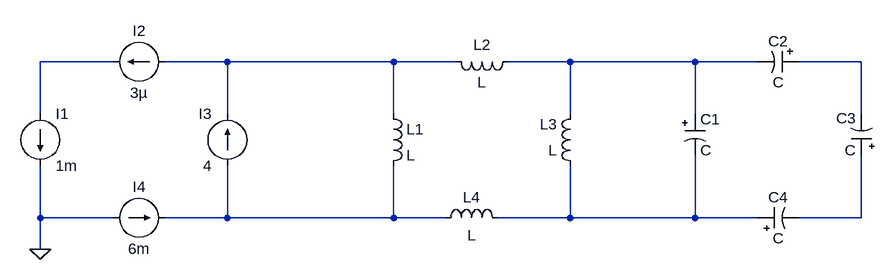
[diagram p0: schematic orientation-test2.asc]
orientation-test2.asc, the LTspice schematic file:
Version 4
SHEET 1 1316 680
WIRE 144 176 32 176
WIRE 320 176 224 176
WIRE 576 176 320 176
WIRE 672 176 576 176
WIRE 848 176 752 176
WIRE 1040 176 848 176
WIRE 1136 176 1040 176
WIRE 1296 176 1200 176
WIRE 32 256 32 176
WIRE 320 256 320 176
WIRE 576 256 576 176
WIRE 848 256 848 176
WIRE 1040 256 1040 176
WIRE 1296 256 1296 176
WIRE 32 416 32 336
WIRE 144 416 32 416
WIRE 320 416 320 336
WIRE 320 416 224 416
WIRE 576 416 576 336
WIRE 576 416 320 416
WIRE 656 416 576 416
WIRE 848 416 848 336
WIRE 848 416 736 416
WIRE 1040 416 1040 320
WIRE 1040 416 848 416
WIRE 1136 416 1040 416
WIRE 1296 416 1296 320
WIRE 1296 416 1200 416
WIRE 32 464 32 416
FLAG 32 464 0
SYMBOL current 32 256 R0
SYMATTR InstName I1
SYMATTR Value 1m
SYMBOL current 224 176 R90
WINDOW 0 -32 40 VBottom 2
WINDOW 3 32 40 VTop 2
SYMATTR InstName I2
SYMATTR Value 3µ
SYMBOL current 320 336 R180
WINDOW 0 24 80 Left 2
WINDOW 3 24 0 Left 2
SYMATTR InstName I3
SYMATTR Value 4
SYMBOL current 144 416 R270
WINDOW 0 32 40 VTop 2
WINDOW 3 -32 40 VBottom 2
SYMATTR InstName I4
SYMATTR Value 6m
SYMBOL ind 560 240 R0
SYMATTR InstName L1
SYMBOL ind 768 160 R90
WINDOW 0 5 56 VBottom 2
WINDOW 3 32 56 VTop 2
SYMATTR InstName L2
SYMBOL ind 864 352 R180
WINDOW 0 36 80 Left 2
WINDOW 3 36 40 Left 2
SYMATTR InstName L3
SYMBOL ind 640 432 R270
WINDOW 0 32 56 VTop 2
WINDOW 3 5 56 VBottom 2
SYMATTR InstName L4
SYMBOL polcap 1024 256 R0
SYMATTR InstName C1
SYMBOL polcap 1200 160 R90
WINDOW 0 0 32 VBottom 2
WINDOW 3 32 32 VTop 2
SYMATTR InstName C2
SYMBOL polcap 1312 320 R180
WINDOW 0 24 57 Left 2
WINDOW 3 24 8 Left 2
SYMATTR InstName C3
SYMBOL polcap 1136 432 R270
WINDOW 0 32 32 VTop 2
WINDOW 3 0 32 VBottom 2
SYMATTR InstName C4

The netlist it stands for:
* orientation-test2.asc
I1 N001 0 1m
I2 N002 N001 3µ
I3 N005 N002 4
I4 0 N005 6m
L1 N002 N005 L
L2 N003 N002 L
L3 N006 N003 L
L4 N005 N006 L
C1 N003 N006 C
C2 N004 N003 C
C3 N007 N004 C
C4 N006 N007 C
.backanno
.end